# Altium project MCU.PrjPcb (part 3 of 3)

## Sheet Buck_Converter.SchDoc
size A; SheetNumber: 6; SheetTotal: 11
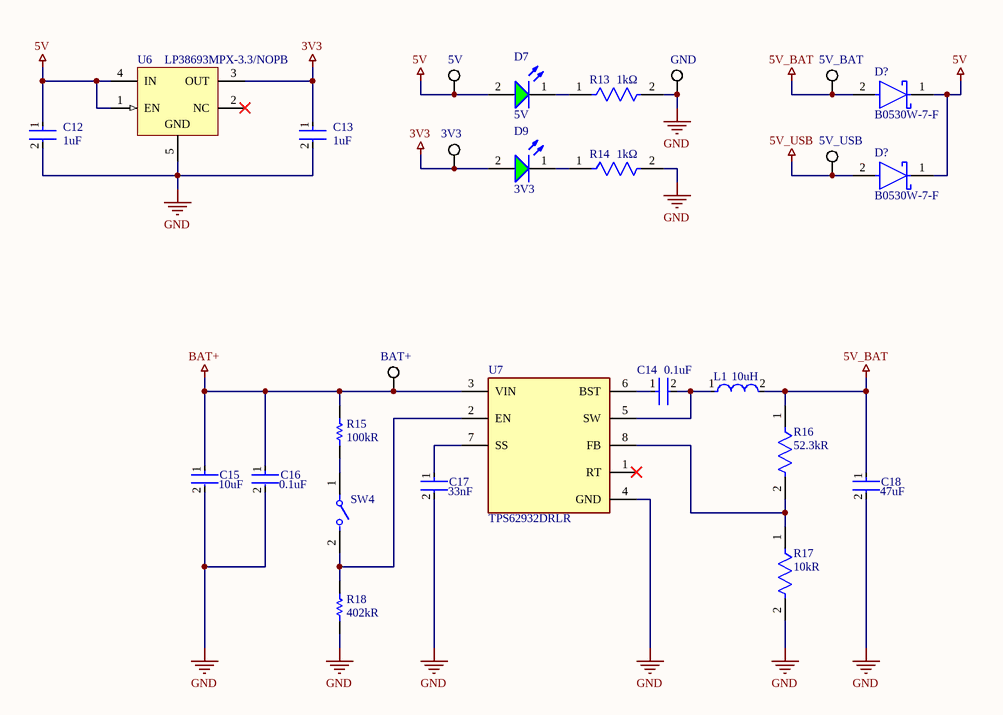
[diagram p5: Buck_Converter.SchDoc]

### Parts
(Parts that share a designator on the sheet are numbered #1, #2 ... from top to bottom, then left to right.)
3V3#2  (no value)  [KSTN-5019_V]
5V#2  (no value)  [KSTN-5019_V]
5V_BAT#2  (no value)  [KSTN-5019_V]
5V_USB#2  (no value)  [KSTN-5019_V]
BAT+#2  (no value)  [KSTN-5019_V]
C12#2  Capacitance: 1uF  [FP-CC0805-0_85-MFG]  (hidden comment: CC0805MKX7R7BB105)
C13#2  Capacitance: 1uF  [FP-CC0805-0_85-MFG]  (hidden comment: CC0805MKX7R7BB105)
C14#2  Capacitance: 0.1uF  [FP-GCD21B-0_15-IPC_B]  (hidden comment: GCD21BR71H104MA01L)
C15#2  Capacitance: 10uF  [FP-GRM21B-0_2-e0_2_0_7-IPC_A]  (hidden comment: GRM21BR61H106KE43L)
C16#2  Capacitance: 0.1uF  [FP-GCD21B-0_15-IPC_B]  (hidden comment: GCD21BR71H104MA01L)
C17#1  Capacitance: 33nF  [FP-C0805C-DN-MFG]  (hidden comment: C0805C333K5RACAUTO)
C18#1  Capacitance: 47uF  [FP-GRM21B-0_2-e0_2_0_7-IPC_A]  (hidden comment: GRM21BR61A476ME15L)
D7  5V  [WL-SMCW_0805_150080xx75000]
D9  3V3  [WL-SMCW_0805_150080xx75000]
D?#1  B0530W-7-F  [FP-SOD123-MFG]
D?#2  B0530W-7-F  [FP-SOD123-MFG]
GND#2  (no value)  [KSTN-5019_V]
L1#2  Inductance: 10uH  [FP-SRP1038A-100M-MFG]  (hidden comment: SRP1038A-100M)
R13#2  Resistance: 1kΩ  [FP-AF0805-IPC_A]  (hidden comment: AF0805FR-071KL)
R14#2  Resistance: 1kΩ  [FP-AF0805-IPC_A]  (hidden comment: AF0805FR-071KL)
R15#2  Resistance: 100kR  [RESC2013X60X30LL20T20]  (hidden comment: SG73S2ATTD1003F)
R16#2  Resistance: 52.3kR  [FP-CRCW0805-e3-IPC_A]  (hidden comment: CRCW080552K3FKEA)
R17#2  Resistance: 10kR  [FP-AF0805-IPC_B]  (hidden comment: AF0805FR-0710KL)
R18#1  Resistance: 402kR  [RESC2013X60X35NL10T20]  (hidden comment: RC0805FR-07402KL)
SW4  L101011MS02Q  [FP-L101011MS02Q-MFG]  (value not drawn)
U6  LP38693MPX-3.3/NOPB  [MP05A_M]
U7  TPS62932DRLR  [FP-DRL0008A-MFG]

### Nets
3V3: 3V3#2.1 C13#2.1 D9.2(A) U6.3(OUT)
5V: 5V#2.1 C12#2.1 D7.2(A) D?#1.1(C) D?#2.1(C) U6.1(EN) U6.4(IN)
5V_BAT: 5V_BAT#2.1 C18#1.1 D?#1.2(A) L1#2.2 R16#2.1
5V_USB: 5V_USB#2.1 D?#2.2(A)
BAT+: BAT+#2.1 C15#2.1 C16#2.1 R15#2.2 U7.3(VIN)
GND: C12#2.2 C13#2.2 C15#2.2 C16#2.2 C17#1.2 C18#1.2 GND#2.1 R13#2.2 R14#2.2 R17#2.2 R18#1.1 U6.5(GND) U7.4(GND)
NetC14#2_1: C14#2.1 U7.6(BST)
NetC14#2_2: C14#2.2 L1#2.1 U7.5(SW)
NetC17#1_1: C17#1.1 U7.7(SS)
NetD7_1: D7.1(K) R13#2.1
NetD9_1: D9.1(K) R14#2.1
NetR15#2_1: R15#2.1 SW4.1
NetR16#2_2: R16#2.2 R17#2.1 U7.8(FB)
NetR18#1_2: R18#1.2 SW4.2 U7.2(EN)

Not connected (* = marked no-connect by the designer): U6 2(NC)*; U7 1(RT)*

### Library data of the parts
3V3#2 5V#2 5V_BAT#2 5V_USB#2 BAT+#2 GND#2 = CMP-1672-00008-1: Test Point, 1 Position SMD, RoHS, Tape and Reel; Manufacturer: Keystone Electronics; Manufacturer Part Number: 5019; Connector Type: Interconnection Device; ComponentLink1Description: Manufacturer URL; Package Quantity: 1000; DatasheetVersion: 03/2014; Packaging: Tape and Reel; ComponentLink2URL: http://www.keyelco.com/product-pdf.cfm?p=1357; ComponentLink1URL: http://www.keyelco.com/; Mount: Surface Mount; Contact Plating: Silver; PackageDescription: 1-Pin Surface Mount Device, Body 3.81 x 2.03 mm; Pins: 1; RoHSCompliant: True; Mounting Technology: Surface Mount; ComponentLink2Description: Datasheet; PackageReference: 5019; Supplier: Digikey; Supplier Part Number: 36-5019CT-ND; RoHS: Yes; Category: Connectors; Stock: 174520; Pricing: 1=0.34, 25=0.2736, 100=0.2234, 250=0.20064, 500=0.19152 (USD); Reach SVHC Compliant: Yes; RoHS Compliant: Yes; ComponentLink3URL: https://datasheet.ciiva.com:443/pdfs/VipMasterIC/IC/KEYC/KEYC-S-A0003063693/KEYC-S-A0003063693-1.pdf?src-supplier=IHS+Markit; ComponentLink3Description: https://datasheet.ciiva.com:443/pdfs/VipMasterIC/IC/KEYC/KEYC-S-A0003063693/KEYC-S-A0003063693-1.pdf?src-supplier=IHS+Markit; ComponentLink4URL: https://datasheet.ciiva.com/16318/m60-2p61-16318395.pdf?src-supplier=Future+Electronics; ComponentLink4Description: https://datasheet.ciiva.com/16318/m60-2p61-16318395.pdf?src-supplier=Future+Electronics; ComponentLink5URL: https://datasheet.ciiva.com/14848/m60-2p61-14848438.pdf?src-supplier=Digikey; ComponentLink5Description: https://datasheet.ciiva.com/14848/m60-2p61-14848438.pdf?src-supplier=Digikey; ComponentLink6URL: https://datasheet.ciiva.com/14848/m60-2p61-14848439.pdf?src-supplier=Digikey; ComponentLink6Description: https://datasheet.ciiva.com/14848/m60-2p61-14848439.pdf?src-supplier=Digikey; ComponentLink7URL: https://datasheet.ciiva.com/14848/m60-2p61-14848437.pdf?src-supplier=Digikey; ComponentLink7Description: https://datasheet.ciiva.com/14848/m60-2p61-14848437.pdf?src-supplier=Digikey; ComponentLink8URL: https://datasheet.ciiva.com/16885/70182998-16885945.pdf?src-supplier=Allied+Electronics; ComponentLink8Description: https://datasheet.ciiva.com/16885/70182998-16885945.pdf?src-supplier=Allied+Electronics
C12#2 C13#2 = CMP-03422-001156-1: CAP CER 1UF 16V X7R 0805; Manufacturer: Yageo; Material: Ceramic; Tolerance: 0.2; Octopart: https://octopart.com/cc0805mkx7r7bb105-yageo-33242308; Footprint Url: http://www.yageo.com/exep/pages/download/literatures/UPY-C_GEN_24.pdf; Height: 0.95mm; Manufacturer Part Number: CC0805MKX7R7BB105; ComponentLink2Description: Datasheet; Device Class L2: Capacitors; Package: CC0805-0.85; RoHS: TRUE; Category: Cap; Device Class L1: Passive Components; Device Class L3: Ceramic Capacitors; Ipc Land Pattern Name: CAPC200125X85; Temperature Range Low: -30°C; ComponentLink2URL: http://www.yageo.com/documents/recent/UPY-GPHC_Y5V_6.3V-to-50V_8.pdf; Temperature: -30°C to +85°C; Automotive: No; Temperature Range High: +85°C; Mouser Description: Multilayer Ceramic Capacitors MLCC - SMD/SMT 1.0uF 16V X7R 20%; Digikey Description: CAP CER 1UF 16V X7R 0805; Voltage Rating: 16 V; Value: 1 uF; Lead Free: Yes; Temperature Characteristic: X7R
C14#2 C16#2 = CMP-06035-004518-1: Chip Multilayer Ceramic Capacitors for Automotive, 0805, 0.10uF, X7R, 15%, 20%, 50V, Grade 1
C15#2 = CMP-06035-004402-1: Chip Multilayer Ceramic Capacitors for General Purpose, 0805, 10uF, X5R, 15%, 10%, 50V; Voltage Rating (DC): 50V; Dielectric: X5R; Tolerance: 10%; Thickness: 1.25mm; Length: 2mm; Width: 1.25mm
C17#1 = CMP-2007-01069-2: CAP CER 0.033UF 50V X7R 0805; Manufacturer: KEMET; Tolerance: 0.1; Temperature Coefficient: 30ppm/°C; Value: 33,000 pF; Material: Ceramic; Temperature Characteristic: X7R; Ipc Land Pattern Name: CAPC200125X78; ComponentLink2Description: Datasheet; Temperature Range High: +125°C; Lead Free: Yes; Height: 0.88mm; Temperature: -55°C to +125°C; Voltage Rating: 50 V; Package: C0805C-DN; Mouser Description: SMD Multilayer Ceramic Capacitor, AEC-Q200 C Series, 0.033 F, 10%, X7R, 50 V, 0805 [2012 Metric]; RoHS: TRUE; Device Class L2: Capacitors; Device Class L1: Passive Components; Digikey Description: CAP CER 0.033UF 50V X7R 0805; Automotive: No; Temperature Range Low: -55°C; Category: Cap; Manufacturer Part Number: C0805C333K5RACAUTO; Device Class L3: Ceramic Capacitors; ComponentLink2URL: https://content.kemet.com/datasheets/KEM_C1003_C0G_SMD.pdf; Octopart: https://octopart.com/c0805c333k5racauto-kemet-21768584
C18#1 = CMP-2000-06341-2: Chip Multilayer Ceramic Capacitors for General Purpose, 0805, 47uF, X5R, 15%, 20%, 10V; Dissipation Factor: 0.035%; Length: 2mm; Voltage Rating: 10V; Mount: Surface Mount; Width: 0.049inch; Voltage Rating (DC): 10V; Lead Free: Lead Free; REACH SVHC: No SVHC; Termination: SMD/SMT; Case/Package: 0805; Dielectric: X5R; Packaging: Tape and Reel; Max Operating Temperature: 85°C; Tolerance: 20%; Thickness: 0.057inch; Dielectric Material: Ceramic; Min Operating Temperature: -55°C; Height: 1.25mm; Case Code (Imperial): 0805; Case Code (Metric): 2012; Depth: 1.25mm; Voltage: 10V
D7 = CMP-1426-00007-3: WURTH ELEKTRONIK - 150080GS75000 - LED, Green, SMD, 0805, 30 mA, 3.2 V, 520 nm; Forward Voltage: 3.2V; Viewing Angle: 140°; Power Dissipation: 105mW; Peak Wavelength: 515nm; Luminous Intensity: 450mcd; Wavelength: 525nm; Max Junction Temperature (Tj): 95°C; Forward Current: 100mA; Test Current: 20mA; Lens Style: Clear, Rectangular; Length: 2mm; Case/Package: 0805; Case Code (Metric): 2012; Color: Green; Max Reverse Voltage (DC): 5V; Height: 700µm; Width: 1.25mm; Packaging: Tape and Reel; Mount: Surface Mount; REACH SVHC: Unknown; RoHS: Compliant; Min Operating Temperature: -40°C; Reverse Voltage: 5V; Max Operating Temperature: 85°C; Dominant Wavelength: 525nm; Case Code (Imperial): 0805
D9 = CMP-1426-00007-3: WURTH ELEKTRONIK - 150080GS75000 - LED, Green, SMD, 0805, 30 mA, 3.2 V, 520 nm; Forward Voltage: 3.2V; Viewing Angle: 140°; Power Dissipation: 105mW; Peak Wavelength: 515nm; Max Reverse Voltage (DC): 5V; Luminous Intensity: 450mcd; Wavelength: 525nm; Max Junction Temperature (Tj): 95°C; Forward Current: 100mA; Test Current: 20mA; Lens Style: Clear, Rectangular; Length: 2mm; Case/Package: 0805; Case Code (Metric): 2012; Color: Green; Height: 700µm; Width: 1.25mm; Packaging: Tape and Reel; Mount: Surface Mount; REACH SVHC: Unknown; RoHS: Compliant; Min Operating Temperature: -40°C; Reverse Voltage: 5V; Max Operating Temperature: 85°C; Dominant Wavelength: 525nm; Case Code (Imperial): 0805
D?#1 D?#2 = CMP-2000-05879-2: DIODE SCHOTTKY 30V 500MA SOD123; Manufacturer: Diodes Inc.; Max Surge Forward Current: 5.5A; Forward Current: 0.5A; Max Junction Temp: +125°C; Standoff Height: 0mm; Capacitance: 170pF; Value: 170pF; Peak Reverse Current: 130uA; Footprint Url: https://www.diodes.com/assets/Package-Files/SOD123.pdf; Device Class L1: Discrete Semiconductors; ComponentLink2Description: Datasheet; Mouser Description: Schottky Diodes & Rectifiers 30V 410mW; Device Class L3: Schottky Diodes; Package: SOD123; Temperature: -65°C to +125°C; Temperature Range Low: -65°C; Lead Free: Yes; Digikey Description: DIODE SCHOTTKY 30V 500MA SOD123; Ipc Land Pattern Name: SOD365155X123-2; Automotive: No; Octopart: https://octopart.com/b0530w-7-f-diodes+inc.-325721; Device Class L2: Diodes; ComponentLink2URL: https://www.diodes.com/assets/Datasheets/ds30139.pdf; RoHS: TRUE; Height: 1.45mm; Max Repetitive Reverse Voltage: 30V; Category: Diode; Temperature Range High: +125°C; Manufacturer Part Number: B0530W-7-F; Reverse Voltage: 30V
L1#2 = CMP-07248-000083-1: FIXED IND 10UH 7.5A 30 MOHM SMD; Tolerance: 20%; Test Frequency: 100kHz; Self Resonant Frequency: 10MHz; Q Factor: 20; Core Material: Carbonyl Powder; Shielding: Shielded; DC Resistance (DCR): 30mR; Saturation Current: 12A; Mount: Surface Mount; Military Standard: Not; Max Operating Temperature: 150°C; Length: 11mm; Min Operating Temperature: -40°C; Ratings: AEC-Q200; Termination: SMD/SMT; RMS Current (Irms): 7.5A; Packaging: Tape and Reel; RoHS Compliant: Yes; Width: 0.394inch; Height: 3.8mm; Package Quantity: 500; DC Current: 7.5A; Case/Package: Nonstandard; Depth: 10.3mm; Max DC Current: 7.5A; Height - Seated (Max): 0.157inch; REACH SVHC: No SVHC; Resistor Type: Wirewound; Current Rating: 7.5A; Inductance Tolerance: 20%
R13#2 R14#2 = CMP-03412-043866-1: Anti-Sulfurated Chip Resistor Automotive Grade 1kΩ 1% 0.125W ±100ppm/°C 0805; Max Power Dissipation: 125mW; Number of Terminations: 2; Series: AF; Length: 0.079inch; Min Operating Temperature: -55°C; Packaging: Tape and Reel; Features: Moisture Resistant; Tolerance: 1%; Resistor Type: Thick Film; RoHS Compliant: Yes; Case/Package: 0805; Height: 0.024inch; Max Operating Temperature: 155°C; Temperature Coefficient: 100ppm/°C; Width: 0.049inch
R15#2 = CMP-2001-02684-1: Manufacturer: KOA Speer; Part Number: SG73S2ATTD1003F
R16#2 = CMP-1013-00705-3: RES Thick Film, 52.3kΩ, 1%, 0.125W, 100ppm/°C, 0805; Voltage Rating: 150V; Power Rating: 125mW; Min Operating Temperature: -55°C; Military Standard: Not; Features: Automotive AEC-Q200; Composition: Thick Film; Case/Package: 0805; Case Code (Imperial): 0805; Length: 2mm; Package Quantity: 10; Radiation Hardening: No; Max Operating Temperature: 155°C; Contact Plating: Tin; Case Code (Metric): 2012; Temperature Coefficient: 100ppm/°C; Weight: 0.000194oz; Number of Pins: 2; Number of Terminations: 2; Depth: 1.25mm; Termination: Solder; Tolerance: 1%; Max Power Dissipation: 125mW; Lead Free: Lead Free; Packaging: Tape and Reel; Width: 0.049inch; Height: 0.45mm; Voltage Rating (DC): 150V
R17#2 = CMP-03412-045858-1: Anti-Sulfurated Chip Resistor Automotive Grade 10kΩ 1% 0.125W ±100ppm/°C 0805; Power Rating: 125mW; Voltage Rating: 150V; Packaging: Tape and Reel; Max Operating Temperature: 155°C; Height: 0.024inch; Features: Moisture Resistant; Case Code (Imperial): 0805; Number of Terminations: 2; Series: AF; Termination: SMD/SMT; Package Quantity: 5000; Temperature Coefficient: 100ppm/°C; RoHS Compliant: Yes; Width: 1.25mm; Weight: 0.000194oz; Tolerance: 1%; Case/Package: 0805; Resistor Type: Thick Film; Max Power Dissipation: 125mW; Case Code (Metric): 2012; Length: 0.079inch; Min Operating Temperature: -55°C
R18#1 = CMP-2001-01136-1: Manufacturer: Yageo; Part Number: RC0805FR-07402KL
SW4 = CMP-10038-000020-1: SWITCH SLIDE SPST 4A 125V; Actuator Length: 5.08mm; Actuator Type: Standard; Contact Current Rating: 2A; Electrical Life: 10000Cycles; Switch Function: On-Off; Voltage Rating (DC): 28V; Actuator Color: Black; Actuator Material: Nylon; Switch Travel: 3.81mm; Max Voltage Rating (AC): 250V; Max Current Rating: 4A; Contact Plating: Silver; Throw Configuration: SPST; Depth: 10.8mm; Package Quantity: 1; Length: 19.1mm; Current Rating: 4A; Max Operating Temperature: 65°C; Orientation: Straight; Radiation Hardening: No; Termination: PC Pins; Max Voltage Rating (DC): 125V; Series: L; Min Operating Temperature: -30°C; Contact Material: Copper; Lead Free: Lead Free; Mount: Through Hole; RoHS Compliant: Yes; Voltage Rating (AC): 125V; Packaging: Bulk; Housing Material: Nylon
U6 = CMP-0062-02672-1: 500mA Low Dropout CMOS Linear Regulators Stable with Ceramic Output Capacitors, 5-pin SOT-223, 2000 Reel; Manufacturer: National Semiconductor; PowerWise: Y; CompType: LDO IC; PinCount: 5; Code_JEDEC: TO-261-AB; ComponentLink3URL: http://www.national.com/pf/LP/LP38693.html; RoHS: Y; ComponentLink1URL: http://www.national.com/; Code_IPC: SOT223-5; PartNumber: LP38693MPX-3.3/NOPB; DatasheetVersion: Jun-2011; High-Reliability: Y; PackageReference: MP05A; ComponentLink4URL: http://www.national.com/packaging/folders/mp05a.html; ComponentLink2Description: LP38693 Datasheet; ComponentLink4Description: MP05A Package Page; PackageDescription: Moldec SOT-223, 6.50 x 3.56 x 1.6mm Body, 5 Lead, 1.5mm Pitch; ComponentLink2URL: http://www.national.com/ds/LP/LP38691.pdf; ComponentLink1Description: Manufacturer URL; ComponentLink3Description: LP38693 Web Page; PackageVersion: revA, Jan-2000
U7 = CMP-04918-000714-1: 3.8-V TO 30-V INPUT, 2-A, 200-KH

## Sheet ESP32-S3.SchDoc
size A; SheetNumber: 7; SheetTotal: 11
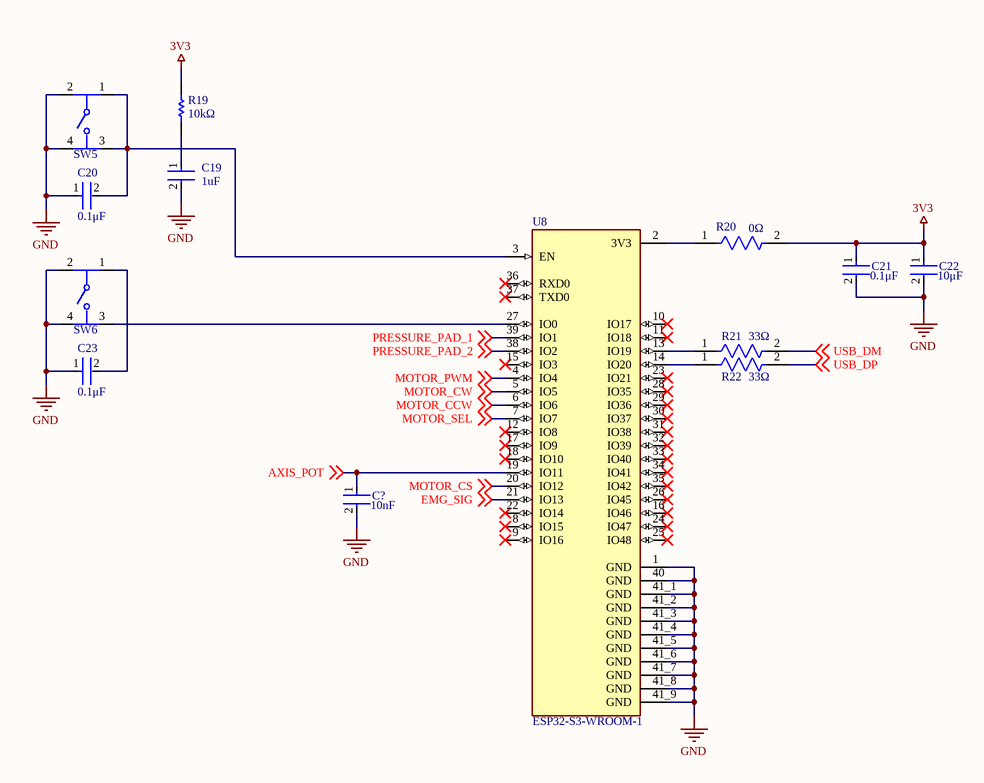
[diagram p6: ESP32-S3.SchDoc]

### Parts
(Parts that share a designator on the sheet are numbered #1, #2 ... from top to bottom, then left to right.)
C19#1  Capacitance: 1uF  [FP-CC0805-0_85-MFG]  (hidden comment: CC0805MKX7R7BB105)
C20#1  Capacitance: 0.1μF  [FP-C0805C-DN-MFG]  (hidden comment: C0805C104K8RACTU)
C21  Capacitance: 0.1μF  [FP-C0805C-DN-MFG]  (hidden comment: C0805C104K8RACTU)
C22  Capacitance: 10μF  [FP-GRT21B-0_2-IPC_B]  (hidden comment: GRT21BC71E106KE13L)
C23  Capacitance: 0.1μF  [FP-C0805C-DN-MFG]  (hidden comment: C0805C104K8RACTU)
C?  Capacitance: 10nF  [FP-C0805C103K8RACAUTO-MFG]  (hidden comment: C0805C103K8RACAUTO)
R19#1  Resistance: 10kΩ  [RESC2013X60X35NL10T20]  (hidden comment: RC0805JR-1310KL)
R20#1  Resistance: 0Ω  [FP-RCC0805-e3-MFG]  (hidden comment: RCC08050000Z0EA)
R21  Resistance: 33Ω  [FP-AC0805-MFG]  (hidden comment: AC0805FR-0733RL)
R22  Resistance: 33Ω  [FP-AC0805-MFG]  (hidden comment: AC0805FR-0733RL)
SW5  TL1105AF160Q  [FP-TL1105AF160Q-MFG]  (value not drawn)
SW6  TL1105AF160Q  [FP-TL1105AF160Q-MFG]  (value not drawn)
U8  ESP32-S3-WROOM-1  [ESP32-S3-WROOM-1]

### Nets
3V3: C21.1 C22.1 R19#1.2 R20#1.2
GND: C19#1.2 C20#1.1 C21.2 C22.2 C23.1 C?.2 SW5.2 SW5.4 SW6.2 SW6.4 U8.1(GND) U8.40(GND) U8.41_1(GND) U8.41_2(GND) U8.41_3(GND) U8.41_4(GND) U8.41_5(GND) U8.41_6(GND) U8.41_7(GND) U8.41_8(GND) U8.41_9(GND)
AXIS_POT: C?.1 U8.19(IO11) ; off-sheet AXIS_POT
EMG_SIG: U8.21(IO13) ; off-sheet EMG_SIG
MOTOR_CCW: U8.6(IO6) ; off-sheet MOTOR_CCW
MOTOR_CS: U8.20(IO12) ; off-sheet MOTOR_CS
MOTOR_CW: U8.5(IO5) ; off-sheet MOTOR_CW
MOTOR_PWM: U8.4(IO4) ; off-sheet MOTOR_PWM
MOTOR_SEL: U8.7(IO7) ; off-sheet MOTOR_SEL
PRESSURE_PAD_1: U8.39(IO1) ; off-sheet PRESSURE_PAD_1
PRESSURE_PAD_2: U8.38(IO2) ; off-sheet PRESSURE_PAD_2
USB_DM: R21.2 ; off-sheet USB_DM
USB_DP: R22.2 ; off-sheet USB_DP
NetC19#1_1: C19#1.1 R19#1.1
NetC20#1_2: C20#1.2 SW5.1 SW5.3 U8.3(EN)
NetC23_2: C23.2 SW6.1
NetR20#1_1: R20#1.1 U8.2(3V3)
NetR21_1: R21.1 U8.13(IO19)
NetR22_1: R22.1 U8.14(IO20)
NetSW6_3: SW6.3 U8.27(IO0)

Not connected (* = marked no-connect by the designer): U8 8(IO15)* 9(IO16)* 10(IO17)* 11(IO18)* 12(IO8)* 15(IO3)* 16(IO46)* 17(IO9)* 18(IO10)* 22(IO14)* 23(IO21)* 24(IO47)* 25(IO48)* 26(IO45)* 28(IO35)* 29(IO36)* 30(IO37)* 31(IO38)* 32(IO39)* 33(IO40)* 34(IO41)* 35(IO42)* 36(RXD0)* 37(TXD0)*

### Library data of the parts
C19#1 = CMP-03422-001156-1: as C12#2 on sheet Buck_Converter; Octopart: https://octopart.com/cc0805mkx7r7bb105-yageo-33242308; Footprint Url: http://www.yageo.com/exep/pages/download/literatures/UPY-C_GEN_24.pdf; Height: 0.95mm; Manufacturer Part Number: CC0805MKX7R7BB105; ComponentLink2Description: Datasheet; Device Class L2: Capacitors; Package: CC0805-0.85; RoHS: TRUE; Category: Cap; Device Class L1: Passive Components; Device Class L3: Ceramic Capacitors; Ipc Land Pattern Name: CAPC200125X85; Temperature Range Low: -30°C; ComponentLink2URL: http://www.yageo.com/documents/recent/UPY-GPHC_Y5V_6.3V-to-50V_8.pdf; Temperature: -30°C to +85°C; Automotive: No; Temperature Range High: +85°C; Mouser Description: Multilayer Ceramic Capacitors MLCC - SMD/SMT 1.0uF 16V X7R 20%; Digikey Description: CAP CER 1UF 16V X7R 0805; Voltage Rating: 16 V; Value: 1 uF; Lead Free: Yes; Temperature Characteristic: X7R
C20#1 C21 C23 = CMP-2007-00281-2: CAP CER 0.1UF 10V 10% X7R 0805; Manufacturer: KEMET; Temperature Coefficient: 30ppm/°C; Tolerance: 0.1; Material: Ceramic; Value: 0.10 μF; Ipc Land Pattern Name: CAPC200125X78; Voltage Rating: 10 V; Temperature: -55°C to +125°C; Octopart: https://octopart.com/c0805c104k8ractu-kemet-9139201; RoHS: TRUE; Category: Cap; Temperature Range High: +125°C; Device Class L1: Passive Components; Manufacturer Part Number: C0805C104K8RACTU; Mouser Description: Multilayer Ceramic Capacitors MLCC - SMD/SMT 10volts 0.1uF X7R 10%; Device Class L2: Capacitors; Automotive: No; Temperature Range Low: -55°C; Temperature Characteristic: X7R; Lead Free: Yes; Device Class L3: Ceramic Capacitors; Height: 0.88mm; ComponentLink2URL: https://content.kemet.com/datasheets/KEM_C1003_C0G_SMD.pdf; Digikey Description: CAP CER 0.1UF 10V 10% X7R 0805; Package: C0805C-DN; ComponentLink2Description: Datasheet
C22 = CMP-06035-008164-1: Multi-Layer Ceramic Capacitor 10uF 25V X7S ±10% 0805 Emboss T/R
C? = CMP-00212-126448506-1: C0805C103K8RACAUTO Cap, 0.01UF, 10V, Mlcc, 0805 Rohs Compliant: Yes; Material: Ceramic; Dielectric: X7R; Tolerance: 10%; Height: 880µm; NexarPartId: 126448506; Voltage Rating: 10V; Voltage Rating (DC): 10V; Min Operating Temperature: -55°C; Max Operating Temperature: 125°C; Case/Package: 0805; RoHS: Compliant
R19#1 = CMP-2001-01415-1: Manufacturer: Yageo; Part Number: RC0805JR-1310KL
R20#1 = CMP-00030-108211984-1: RCC08050000Z0EA Res Thick Film 0805 0 Ohm Conformal Coated Pad SMD Automotive AEC-Q200 T/R; Voltage Rating: 200V; Power Rating: 250mW; Composition: Thick Film; Max Operating Temperature: 155°C; Case/Package: 0805; Height: 500µm; NexarPartId: 108211984; Min Operating Temperature: -55°C
R21 R22 = CMP-03412-037241-1: RES SMD 33 OHM 1% 1/8W 0805; Manufacturer: Yageo; Automotive Grade: Grade 0; Value: 33Ω; Voltage Rating: 150V; Tolerance: 0.01; Octopart: https://octopart.com/ac0805fr-0733rl-yageo-46503501; Device Class L2: Resistors; Temperature: -55°C to +155°C; Composition: Thick Film; ComponentLink2URL: http://www.yageo.com/documents/recent/PYu-AC_51_RoHS_L_6.pdf; Automotive: Yes; Lead Free: Yes; Category: Res; Package: AC0805; Temperature Range Low: -55°C; Device Class L3: Chip SMD Resistors; Temperature Range High: +155°C; Mouser Description: Thick Film Resistors - SMD 1/8W 33ohm 1% AEC-Q200; Footprint Url: http://www.yageo.com/exep/pages/download/literatures/PYu-R_Mount_10.pdf; Power Rating: 1/8W; RoHS: TRUE; ComponentLink2Description: Datasheet; Device Class L1: Passive Components; Height: 0.6mm; Series: AC; Digikey Description: RES SMD 33 OHM 1% 1/8W 0805; Ipc Land Pattern Name: RESC200125X50; Manufacturer Part Number: AC0805FR-0733RL
SW5 SW6 = CMP-17879-000016-1: SWITCH TACTILE SPST-NO 0.05A 12V; Mechanical Life: 100000Cycles; Contact Current Rating: 50mA; Contact Resistance: 100mR; Switch Function: Off-Mom; Actuator Type: Standard; Actuator Length: 1.4mm; Max Voltage Rating (DC): 50V; Throw Configuration: SPST; Actuator Material: Nylon; Illumination Type: Non-Illuminated; Switch Travel: 0.25mm; Operating Force: 160gf; Package Quantity: 750; Width: 6mm; Series: TL1105; Voltage Rating (DC): 12V; Length: 6mm; Contact Plating: Silver; Color: Black; Housing Material: Nylon; Min Operating Temperature: -20°C; Lead Free: Lead Free; Mount: Through Hole; Termination: PC Pin; RoHS Compliant: Yes; Orientation: Straight; Max Operating Temperature: 70°C; Reach SVHC Compliant: Yes; Packaging: Bulk; Electrical Life: 100000Cycles; Current Rating: 50mA; Contact Material: Bronze; Size: 6mm
U8 = ESP32-S3-WROOM-1: MF: {'manufacturer': u'Espressif Systems'}; MP: ESP32-S3-WROOM-1-N8; Package: None; Price: None; Value: *; Availability: Unavailable; Supplier 1: DigiKey; Supplier Part Number 1: 5407-ESP32-S3-WROOM-1-N8CT-ND

## Sheet Axis_Potentiometer.SchDoc
size A; SheetNumber: 5; SheetTotal: 4
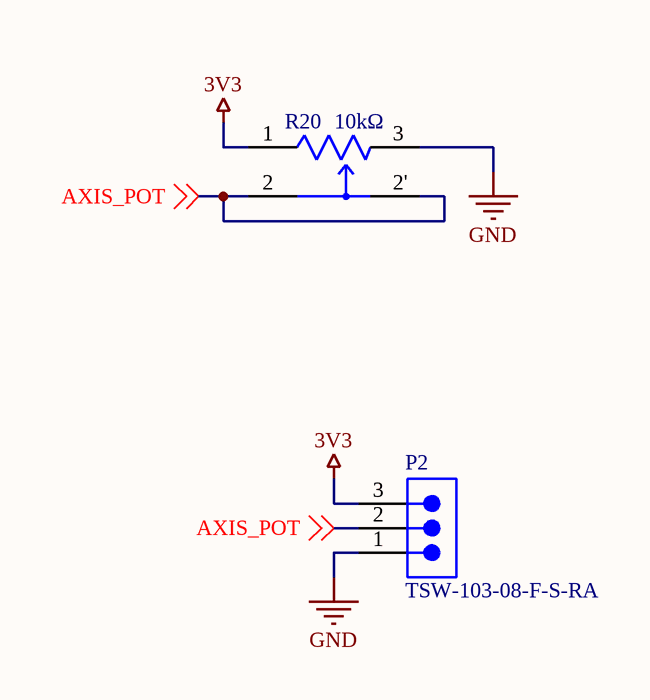
[diagram p7: Axis_Potentiometer.SchDoc]

### Parts
(Parts that share a designator on the sheet are numbered #1, #2 ... from top to bottom, then left to right.)
P2  TSW-103-08-F-S-RA  [SMTC-TSW-103-08-X-S-RA]
R20#2  Resistance: 10kΩ  [FP-EVW-AE4001B14-MFG]  (hidden comment: EVW-AE4001B14)

### Nets
3V3: P2.3 R20#2.1
GND: P2.1 R20#2.3
AXIS_POT: P2.2 R20#2.2 R20#2.2' ; off-sheet AXIS_POT

### Library data of the parts
P2 = CMP-1024-00344-1: 0.025" SQ Post Header, Through-hole, Right Angle, -55 to 125 degC, 2.54 mm Pitch, 3-Pin, Male, RoHS; Manufacturer: Samtec; Pitch: 2.54 mm; PackageVersion: DM, 8/1988; ComponentLink3Description: Package Specification; ComponentLink2Description: Datasheet; PackageDescription: .025[0.64] SQ. Post Terminal Strip Assembly; ComponentLink3URL: http://www.samtec.com/documents/webfiles/cpdf/TSW-XXX-XX-XXX-X-XX-XXX-MKT.pdf; ComponentLink1URL: http://www.samtec.com; Mounting Technology: Through-hole; ComponentLink2URL: http://www.samtec.com/documents/webfiles/pdf/TSW_TH.PDF; RoHS: True; Temperature Range: -55 to 125 degC; Orientation: Right Angle; DatasheetVersion: F-214; ComponentLink1Description: Manufacturer URL; PackageReference: TSW-103-08-X-S-RA; PartNumber: TSW-103-08-F-S-RA
R20#2 = CMP-00287-39595731-1: EVW-AE4001B14 Res POT 10K Ohm 30% 1/20W 4mm (10.6 X 15.4 X 3.4mm) Thru-Hole Embossed T/R; Max Supply Voltage: 5V; Power Rating: 50mW; Sensing Method: Resistive; Linearity: 2%; Min Operating Temperature: -40°C; Tolerance: 30%; NexarPartId: 39595731; Termination: SMD/SMT; Contact Plating: Silver; Mount: Surface Mount, Through Hole; Packaging: Cut Tape; Length: 10.6mm; Lead Free: Lead Free; Depth: 15.4mm; RoHS: Compliant; Military Standard: Not; Radiation Hardening: No; Composition: Potentiometer; Min Supply Voltage (DC): 5V; Schedule B: 8536509065, 8536509065; Max Operating Temperature: 85°C; Number of Pins: 4; Type: Potentiometer; REACH SVHC: Unknown

## Sheet Power_Switch.SchDoc
size A; SheetNumber: 9; SheetTotal: 9

## Sheet Motor_Driver.SchDoc
size A; SheetNumber: 10; SheetTotal: 11
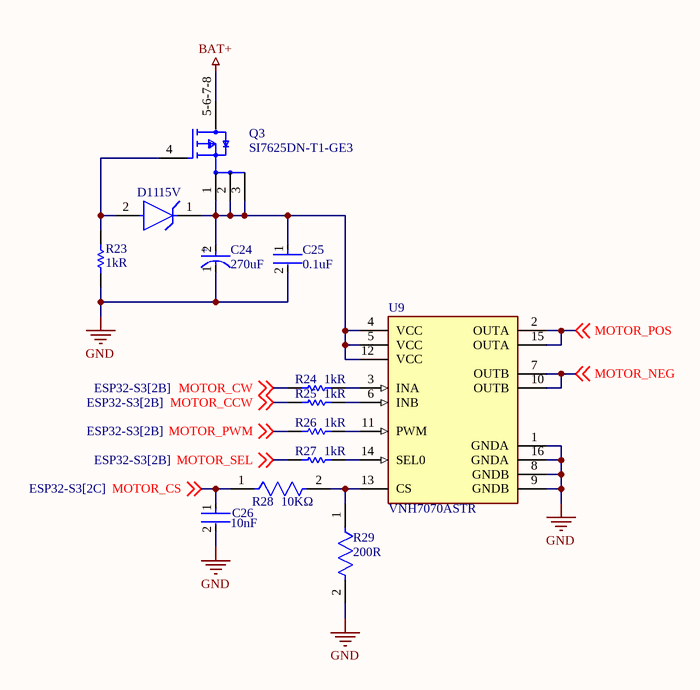
[diagram p8: Motor_Driver.SchDoc]

### Parts
C24  Capacitance: 270uF  [FP-EEH-G-V-MFG]  (hidden comment: EEHZA1V271V)
C25  Capacitance: 0.1uF  [FP-GCD21B-0_15-IPC_B]  (hidden comment: GCD21BR71H104MA01L)
C26  Capacitance: 10nF  [FP-C0805C103K8RACAUTO-MFG]  (hidden comment: C0805C103K8RACAUTO)
D11  Nom Zener Voltage: 15V  [FP-SOD123-MFG]  (hidden comment: MMSZ5245B-7-F)
Q3  SI7625DN-T1-GE3  [FP-S16-2667-SINGLE-MFG]
R23  Resistance: 1kR  [RESC2013X60X35LL10T20]  (hidden comment: AC0805JR-071KL)
R24  Resistance: 1kR  [RESC2013X60X35LL10T20]  (hidden comment: AC0805JR-071KL)
R25  Resistance: 1kR  [RESC2013X60X35LL10T20]  (hidden comment: AC0805JR-071KL)
R26  Resistance: 1kR  [RESC2013X60X35LL10T20]  (hidden comment: AC0805JR-071KL)
R27  Resistance: 1kR  [RESC2013X60X35LL10T20]  (hidden comment: AC0805JR-071KL)
R28  Resistance: 10KΩ  [FP-SR0805-MFG]  (hidden comment: SR0805FR-4710KL)
R29  Resistance: 200R  [FP-CRCW0805-HPe3-IPC_B]  (hidden comment: CRCW0805200RFKEAHP)
U9  VNH7070ASTR  [FP-SO-16N-GAPGCFT00818-MFG]

### Nets
BAT+: Q3.5-6-7-8(D)
GND: C24.1(C) C25.2 C26.2 R23.1 R29.2 U9.1(GNDA) U9.8(GNDB) U9.9(GNDB) U9.16(GNDA)
MOTOR_CCW: R25.1 ; off-sheet MOTOR_CCW
MOTOR_CS: C26.1 R28.1 ; off-sheet MOTOR_CS
MOTOR_CW: R24.1 ; off-sheet MOTOR_CW
MOTOR_NEG: U9.7(OUTB) U9.10(OUTB) ; off-sheet MOTOR_NEG
MOTOR_POS: U9.2(OUTA) U9.15(OUTA) ; off-sheet MOTOR_POS
MOTOR_PWM: R26.1 ; off-sheet MOTOR_PWM
MOTOR_SEL: R27.1 ; off-sheet MOTOR_SEL
NetC24_2: C24.2(A) C25.1 D11.1(C) Q3.1(S) Q3.2(S) Q3.3(S) U9.4(VCC) U9.5(VCC) U9.12(VCC)
NetD11_2: D11.2(A) Q3.4(G) R23.2
NetR24_2: R24.2 U9.3(INA)
NetR25_2: R25.2 U9.6(INB)
NetR26_2: R26.2 U9.11(PWM)
NetR27_2: R27.2 U9.14(SEL0)
NetR28_2: R28.2 R29.1 U9.13(CS)

### Notes on the sheet
- (in symbol CMP-05428-000576-1) +

### Library data of the parts
C24 = CMP-05428-000576-1: Aluminum Hybrid Polymer Capacitors 270uF 20% 35V Life 10000Hours AEC-Q200 RADIAL SMT; ESR (Equivalent Series Resistance): 20mR; Series: ZA; Ratings: AEC-Q200; Resistor Type: Hybrid; Tolerance: 20%; RoHS Compliant: Yes; Max Operating Temperature: 105°C; Min Operating Temperature: -55°C; Packaging: Cut Tape; Life (Hours): 10000Hour; Voltage Rating: 35V; Mount: Surface Mount; Case/Package: Radial
C25 = CMP-06035-004518-1: as C14#2 on sheet Buck_Converter
C26 = CMP-00212-126448506-1: as C? on sheet ESP32-S3; Height: 880µm; NexarPartId: 126448506; Voltage Rating: 10V; Voltage Rating (DC): 10V; Min Operating Temperature: -55°C; Max Operating Temperature: 125°C; Case/Package: 0805; RoHS: Compliant
D11 = CMP-12792-000001-1: DIODE ZENER 15V 500MW SOD123; Manufacturer: Diodes Inc.; Power Dissipation: 370mW; Max Zener Voltage: 15.75V; Max Junction Temp: +150°C; Zener Impedance: 16Ω; Standoff Height: 0mm; Reverse Voltage: 11V; Max Reverse Leakage Current: 0.1uA; Device Class L3: Zener Diodes; Device Class L2: Diodes; Automotive: No; Device Class L1: Discrete Semiconductors; ComponentLink2URL: https://www.diodes.com/assets/Datasheets/ds18010.pdf; Package: SOD123; ComponentLink2Description: Datasheet; Digikey Description: DIODE ZENER 15V 500MW SOD123; RoHS: TRUE; Temperature: -65°C to +150°C; Octopart: https://octopart.com/mmsz5245b-7-f-diodes+inc.-332054; Mouser Description: Zener Diodes 15V 500mW; Height: 1.45mm; Temperature Range Low: -65°C; Lead Free: Yes; Manufacturer Part Number: MMSZ5245B-7-F; Footprint Url: https://www.diodes.com/assets/Package-Files/SOD123.pdf; Category: Diode; Temperature Range High: +150°C
Q3 = CMP-00030-44451668-1: SI7625DN-T1-GE3 P-Channel 30 V 7 mO 5126 nC Surface Mount Power Mosfet - PowerPAK-1212-8; Number of Channels: 1; Max Power Dissipation: 52W; Drain to Source Resistance: 7mΩ; Threshold Voltage: -1V; Power Dissipation: 3.7W; Input Capacitance: 4.427nF; Element Configuration: Single; Gate to Source Voltage (Vgs): 20V; Drain to Source Voltage (Vdss): -30V; Continuous Drain Current (ID): 17.3A; Lead Free: Lead Free; Number of Pins: 8; Min Operating Temperature: -55°C; NexarPartId: 44451668; Schedule B: 8541290080, 8541290080; Radiation Hardening: No; Rds On Max: 7mΩ; Number of Elements: 1; Max Operating Temperature: 150°C; Mount: Surface Mount; Resistance: 7MΩ; Packaging: Digi-Reel®; REACH SVHC: No SVHC; RoHS: Compliant
R23-R27 = CMP-2001-04511-1: Manufacturer: Yageo; Part Number: AC0805JR-071KL
R28 = CMP-03412-005404-1: RES SMD 0805 1/2W 1% 10K OHM; Manufacturer: Yageo; Value: 10KΩ; Power Rating: 0.5W; Voltage Rating: 150V; Tolerance: 0.01; Automotive Grade: Grade 0; RoHS: TRUE; Package: SR0805; Temperature: -55°C to +155°C; Composition: Thick Film; Lead Free: Yes; Ipc Land Pattern Name: RESC200125X50; Footprint Url: http://www.yageo.com/exep/pages/download/literatures/PYu-R_Mount_10.pdf; ComponentLink2URL: http://www.yageo.com/documents/recent/PYu-SR_D_F%20tol_RoHS_L_3.pdf; Series: SR; Device Class L3: Chip SMD Resistors; Manufacturer Part Number: SR0805FR-4710KL; Device Class L2: Resistors; Digikey Description: RES SMD 0805 1/2W 1% 10K OHM; Category: Res; Temperature Range Low: -55°C; ComponentLink2Description: Datasheet; Automotive: Yes; Height: 0.6mm; Octopart: https://octopart.com/sr0805fr-4710kl-yageo-91478094; Device Class L1: Passive Components; Temperature Range High: +155°C
R29 = CMP-02407-008327-1: RES Thick Film, 200Ω, 1%, 0.5W, 100ppm/°C, 0805; Max Power Dissipation: 500mW; Min Operating Temperature: -55°C; Composition: Thick Film; Depth: 1.25mm; Max Operating Temperature: 155°C; Case/Package: 0805; Height: 0.024inch; Length: 2mm; Package Quantity: 5000; Military Standard: Not; Mount: Surface Mount; Contact Plating: Tin; Width: 0.049inch; Radiation Hardening: No; Packaging: Tape and Reel; Features: Automotive AEC-Q200; Number of Terminations: 2; Tolerance: 1%; Temperature Coefficient: 100ppm/°C; Lead Free: Lead Free
U9 = CMP-2000-07519-2: IC MOTOR DRIVER 4V-28V 16SOIC; Manufacturer: STMicroelectronics; Standoff Height: 0.1mm; Number Of Outputs: 2; Max Junction Temp: +150°C; Output Current: 15A; Max Supply Voltage: 28V; Automotive Grade: Grade 0; Motor Type: Brushed; Min Supply Voltage: 4V; Nominal Supply Current: 2-3.5mA; Digikey Description: IC MOTOR DRIVER 4V-28V 16SOIC; Device Class L1: Integrated Circuits (ICs); Ipc Land Pattern Name: SOIC127P600X175-16; Device Class L2: Power Management ICs; ComponentLink2Description: Datasheet; ComponentLink2URL: https://www.st.com/resource/en/datasheet/vnh7070as.pdf; Height: 1.75mm; RoHS: TRUE; Manufacturer Part Number: VNH7070ASTR; Octopart: https://octopart.com/vnh7070astr-stmicroelectronics-66668687; Temperature Range Low: -40°C; Mouser Description: STMicroelectronics VNH7070ASTR Motor Driver IC 16-Pin, SOIC; Device Class L3: Motor Drivers; Lead Free: Yes; Temperature: -40°C to +150°C; Automotive: Yes; Package: SO-16N-GAPGCFT00818; Temperature Range High: +150°C; Category: IC; Footprint Url: https://www.st.com/resource/en/datasheet/l6566a.pdf

## Sheet Connectors.SchDoc
size A; SheetNumber: 4; SheetTotal: 4
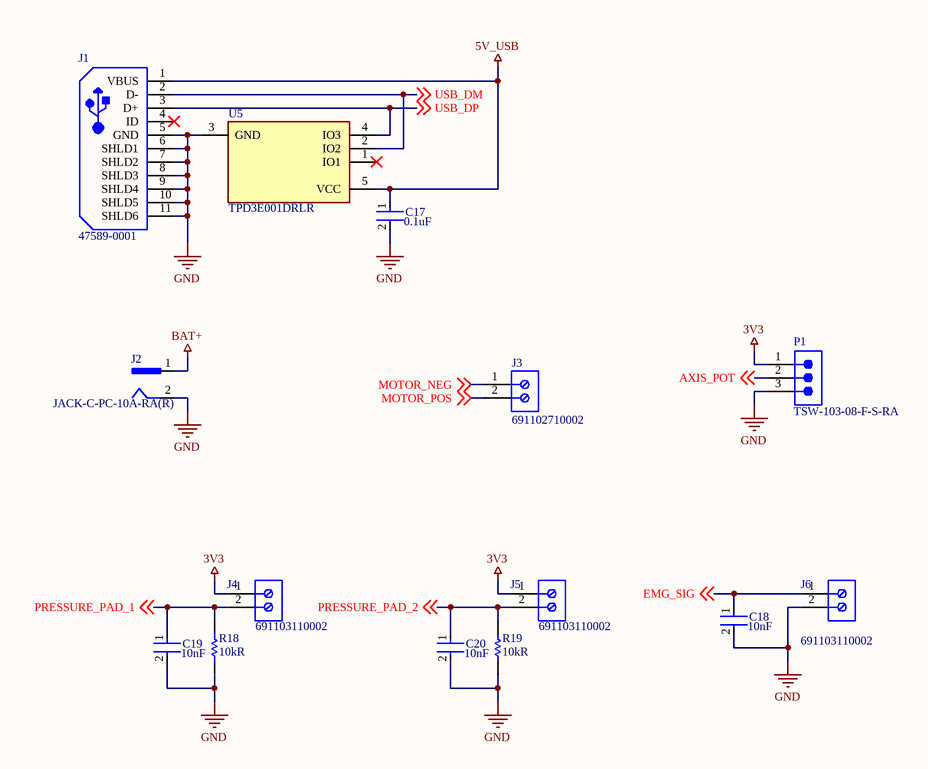
[diagram p9: Connectors.SchDoc]

### Parts
(Parts that share a designator on the sheet are numbered #1, #2 ... from top to bottom, then left to right.)
C17#2  Capacitance: 0.1uF  [FP-GCD21B-0_15-IPC_B]  (hidden comment: GCD21BR71H104MA01L)
C18#2  Capacitance: 10nF  [FP-C0805C103K8RACAUTO-MFG]  (hidden comment: C0805C103K8RACAUTO)
C19#2  Capacitance: 10nF  [FP-C0805C103K8RACAUTO-MFG]  (hidden comment: C0805C103K8RACAUTO)
C20#2  Capacitance: 10nF  [FP-C0805C103K8RACAUTO-MFG]  (hidden comment: C0805C103K8RACAUTO)
J1  47589-0001  [MOLX-47589-0001_V]
J2#2  JACK-C-PC-10A-RA(R)  [GLOBTECK_JACK-C-PC-10A-RA(R)]
J3  691102710002  [691102710002]
J4  691103110002  [691103110002]
J5  691103110002  [691103110002]
J6  691103110002  [691103110002]
P1  TSW-103-08-F-S-RA  [SMTC-TSW-103-08-X-S-RA]
R18#2  value 10kR  [RESC2013X60X35NL10T20]  (hidden comment: RC0805FR-0710KL)
R19#2  value 10kR  [RESC2013X60X35NL10T20]  (hidden comment: RC0805FR-0710KL)
U5  TPD3E001DRLR  [FP-DRL0005A-MFG]

### Nets
3V3: J4.1 J5.1 P1.1
5V_USB: C17#2.1 J1.1(VBUS) U5.5(VCC)
BAT+: J2#2.1
GND: C17#2.2 C18#2.2 C19#2.2 C20#2.2 J1.5(GND) J1.6(SHLD1) J1.7(SHLD2) J1.8(SHLD3) J1.9(SHLD4) J1.10(SHLD5) J1.11(SHLD6) J2#2.2 J6.2 P1.3 R18#2.2 R19#2.2 U5.3(GND)
AXIS_POT: P1.2 ; off-sheet AXIS_POT
EMG_SIG: C18#2.1 J6.1 ; off-sheet EMG_SIG
MOTOR_NEG: J3.1 ; off-sheet MOTOR_NEG
MOTOR_POS: J3.2 ; off-sheet MOTOR_POS
PRESSURE_PAD_1: C19#2.1 J4.2 R18#2.1 ; off-sheet PRESSURE_PAD_1
PRESSURE_PAD_2: C20#2.1 J5.2 R19#2.1 ; off-sheet PRESSURE_PAD_2
USB_DM: J1.2(D-) U5.2(IO2) ; off-sheet USB_DM
USB_DP: J1.3(D+) U5.4(IO3) ; off-sheet USB_DP

Not connected (* = marked no-connect by the designer): J1 4(ID)*; U5 1(IO1)*

### Library data of the parts
C17#2 = CMP-06035-004518-1: as C14#2 on sheet Buck_Converter
C18#2 C19#2 C20#2 = CMP-00212-126448506-1: as C? on sheet ESP32-S3; Height: 880µm; NexarPartId: 126448506; Voltage Rating: 10V; Voltage Rating (DC): 10V; Min Operating Temperature: -55°C; Max Operating Temperature: 125°C; Case/Package: 0805; RoHS: Compliant
J1 = CMP-2000-05610-1: Right Angle Female Type AB Micro USB Connector, 30 V, 1.8 A, -30 to 85 degC, RoHS, Tape and Reel; Number of Ports: 1Port; Current Rating: 1.8A; Brand: Molex; Connector Type: MicroUSBTypeABreceptacle; Number of Contacts: 5Contact; Voltage Rating: 30VAC; Color: Black; Product: MicroUSBTypeABConnectors; Package URL: http://www.molex.com/pdm_docs/sd/475890001_sd.pdf; Contact Plating: Gold; Datasheet URL: http://www.molex.com/webdocs/datasheets/pdf/en-us/0475890001_IO_CONNECTORS.pdf; Operating Temperature Range: -20Cto+85C; Termination Style: SMD/SMT; Mounting Angle: Right; Package Reference: 47589-0001; Gender: Female; Package Description: Micro USB Connector, Pitch 0.65 mm, 5 Positions, Body 7.5 x 5.6 mm; Mounting Technology: SurfaceMount; Contact Material: CopperAlloy; Packaging: Reel; RoHS: True; Standard: USB; Manufacturer URL: http://www.molex.com/; Manufacturer: Molex; Datasheet Version: 12/2016; Product Category: USBConnectors; Series: 47589
J2#2 = JACK-C-PC-10A-RA(R): Power Barrel Connector Jack 2.10mm ID _0.083_, 5.50mm OD _0.217_ Through Hole, Right Angle; MF: GlobTek, Inc.; MP: JACK-C-PC-10A-RA_R_; Value: *; Digi-Key_Purchase_URL: https://www.digikey.com/product-detail/en/globtek-inc/JACK-C-PC-10A-RA_R_/1939-1086-ND/8597889?utm_source=snapeda&utm_medium=aggregator&utm_campaign=symbol; Digi-Key_Part_Number: 1939-1086-ND; Package: None; SnapEDA_Link: https://www.snapeda.com/parts/JACK-C-PC-10A-RA%28R%29/GlobTek%2C%20Inc./view-part/3076017/?ref=snap
J3 = CMP-1502-03258-3: 102 Series 5MM Pitch Straight, Pcb Terminal Block, Through Hole, 2 Way; Current Rating: 15A; Wire/Cable Gauge: 22AWG; Voltage: 300V; Number of Positions Per Level: 2; Plating: Steel; Stripping Length: -6mm; Wire Gauge (Min): 14AWG; Number of Levels: 1; Pitch: 5.0038mm; Width: 11.2mm; Max Operating Temperature: 105°C; Contact Material: Brass; Contact Plating: Tin; Current: 15A; Wire Gauge (Max): 22AWG; Mount: Through Hole; Length: 7.5mm; Min Operating Temperature: -40°C; RoHS: Compliant; Color: Blue; Number of Pins: 2; Housing Material: Nylon; Termination: Screw; Height: 13.4mm; Number of Contacts: 2; Lead Pitch: 5mm; Voltage Rating: 300V; Packaging: Box
J4-J6 = CMP-1502-03254-3: 1031 Series 3.5MM Pitch Straight, Pcb Terminal Block, Through Hole, 2 Way; Pitch: 3.5052mm; Current Rating: 10A; Number of Positions Per Level: 2; Plating: Steel; Number of Levels: 1; Voltage: 125V; Wire/Cable Gauge: 26AWG; Stripping Length: -6mm; Wire Gauge (Min): 16AWG; Packaging: Box; Number of Rows: 1; Color: Blue; Height: 8.5mm; Current: 10A; Lead Pitch: 3.5mm; RoHS: Compliant; Housing Material: Nylon; Width: 8mm; Length: 7mm; Contact Plating: Tin; Number of Pins: 2; Mount: Through Hole; Min Operating Temperature: -40°C; Number of Contacts: 2; Termination: Screw; Wire Gauge (Max): 26AWG; Max Operating Temperature: 105°C; Voltage Rating: 125V; Contact Material: Copper, Nickel, Tin, Zinc
P1 = CMP-1024-00344-1: as P2 on sheet Axis_Potentiometer; PackageVersion: DM, 8/1988; ComponentLink3Description: Package Specification; ComponentLink2Description: Datasheet; PackageDescription: .025[0.64] SQ. Post Terminal Strip Assembly; ComponentLink3URL: http://www.samtec.com/documents/webfiles/cpdf/TSW-XXX-XX-XXX-X-XX-XXX-MKT.pdf; ComponentLink1URL: http://www.samtec.com; Mounting Technology: Through-hole; ComponentLink2URL: http://www.samtec.com/documents/webfiles/pdf/TSW_TH.PDF; RoHS: True; Temperature Range: -55 to 125 degC; Orientation: Right Angle; DatasheetVersion: F-214; ComponentLink1Description: Manufacturer URL; PackageReference: TSW-103-08-X-S-RA; PartNumber: TSW-103-08-F-S-RA
R18#2 R19#2 = CMP-1659-00013-4: Chip Resistor, 10 KOhm, +/- 1%, 0.125 W, -55 to 155 degC, 0805 (2012 Metric), RoHS, Tape and Reel; Manufacturer: Yageo; Voltage Rating: 150 V; Power: 125mW; Rated Temperature: 70°C; Temperature Coefficient: 100ppm/°C; Additional Feature: LASER TRIMMABLE; Working Voltage: 150V; Package Length: 2mm; Package Height: 0.5mm; Package Width: 1.25mm; Mount: Surface Mount; ComponentLink1Description: Manufacturer URL; ComponentLink2URL: http://www.yageo.com/documents/recent/PYu-RC_Group_51_RoHS_L_04.pdf; Pins: 2; Length: 2 mm; Min Operating Temperature: -55 degC; Height: 0.5 mm; Mounting Technology: Surface Mount; RoHSCompliant: true; REACH SVHC: No SVHC; ComponentLink1URL: http://www.yageo.com/; Max Operating Temperature: 155 degC; PackageReference: 0805; DatasheetVersion: Rev. 4, 02/2016; Package Quantity: 5000; Packaging: Tape and Reel; ComponentLink2Description: Datasheet; PackageDescription: 2-Pin Surface Mounted Device, Body 2 x 1.25 mm; Supplier: Digikey; Supplier Part Number: 311-10.0KCRCT-ND; Manufacturer Part Number: RC0805FR-0710KL; RoHS: Yes; Category: Chip SMD Resistors; Stock: 4430741; Pricing: 1=0.1, 10=0.027, 50=0.017, 100=0.0142, 500=0.00976, 1000=0.00844 (USD); Package Shape: Rectangular; Terminal Finish: Nickel; Case/Package: 0805; Tolerance: 1%; JESD-609 Code: e3; Resistor Type: FIXED RESISTOR; Construction: Chip; Package Style: SMTMeter; Technology: METAL GLAZE/THICK FILM; Termination: Wraparound; Reach SVHC Compliant: Yes; RoHS Compliant: Yes; ComponentLink3URL: https://datasheet.ciiva.com:443/pdfs/VipMasterIC/IC/YAGO/YAGO-S-A0008145938/YAGO-S-A0008145938-1.pdf?src-supplier=IHS+Markit; ComponentLink3Description: https://datasheet.ciiva.com:443/pdfs/VipMasterIC/IC/YAGO/YAGO-S-A0008145938/YAGO-S-A0008145938-1.pdf?src-supplier=IHS+Markit; ComponentLink4URL: https://datasheet.ciiva.com/11808/0900766b8106beab-11808151.pdf?src-supplier=Rs; ComponentLink4Description: https://datasheet.ciiva.com/11808/0900766b8106beab-11808151.pdf?src-supplier=Rs; ComponentLink5URL: https://datasheet.ciiva.com/46447/444164-46447563.pdf?src-supplier=Element14; ComponentLink5Description: https://datasheet.ciiva.com/46447/444164-46447563.pdf?src-supplier=Element14; ComponentLink6URL: https://datasheet.ciiva.com/2456/pyu-r-int-thick-7-2456973.pdf?src-supplier=Digikey; ComponentLink6Description: https://datasheet.ciiva.com/2456/pyu-r-int-thick-7-2456973.pdf?src-supplier=Digikey; ComponentLink7URL: https://datasheet.ciiva.com/2456/pyu-r-int-thick-7-2456974.pdf?src-supplier=Digikey; ComponentLink7Description: https://datasheet.ciiva.com/2456/pyu-r-int-thick-7-2456974.pdf?src-supplier=Digikey; ComponentLink8URL: https://datasheet.ciiva.com/2456/pyu-r-int-thick-7-2456972.pdf?src-supplier=Digikey; ComponentLink8Description: https://datasheet.ciiva.com/2456/pyu-r-int-thick-7-2456972.pdf?src-supplier=Digikey; ComponentLink9URL: https://datasheet.ciiva.com/12669/rc0805-12669688.pdf?src-supplier=Mouser; ComponentLink9Description: https://datasheet.ciiva.com/12669/rc0805-12669688.pdf?src-supplier=Mouser; ComponentLink10URL: https://datasheet.ciiva.com/16747/rc0805-16747087.pdf?src-supplier=Future+Electronics; ComponentLink10Description: https://datasheet.ciiva.com/16747/rc0805-16747087.pdf?src-supplier=Future+Electronics
U5 = CMP-0326-00052-4: TVS DIODE 5.5V SOT5; Min Supply Voltage: 900mV; Number of Bidirectional Channels: 3; Peak Pulse Power: 90W; Direction: Unidirectional; Leakage Current: 1nA; Interface: USB; Max Supply Current: 100nA; Capacitance: 1.5pF; Breakdown Voltage: 11V; Clamping Voltage: 105.5V; Power Line Protection: Yes; Packaging: Tape and Reel; Length: 1.6mm; REACH SVHC: No SVHC; Min Operating Temperature: -40°C; Lead Free: Lead Free; Max Supply Voltage: 5.5V; RoHS Compliant: Yes; Termination: SMD/SMT; Number of Channels: 3; Max Supply Voltage (DC): 5.5V; Weight: 9.9E-05oz; Package Quantity: 1; Reverse Standoff Voltage: 5.5V; Number of Pins: 5; Case/Package: SOT-553; Max Operating Temperature: 85°C; Nominal Supply Current: 1nA; Width: 1.2mm; Min Breakdown Voltage: 11V; Min Supply Voltage (DC): 900mV; Height: 0.55mm; Radiation Hardening: No; Depth: 1.2mm

## Nets that join several sheets
3V3: MCU (C10#1.1 C11#1.1 R7#1.1 U3.2), Power (3V3#1.1 C2.1 D3#1.2 U1.3), USB (C8#2.1 R7#2.2 U4#1.6 U4#1.7), Buck_Converter (3V3#2.1 C13#2.1 D9.2 U6.3), ESP32-S3 (C21.1 C22.1 R19#1.2 R20#1.2), Axis_Potentiometer (P2.3 R20#2.1), Connectors (J4.1 J5.1 P1.1)
5V: Power (7 pins), Buck_Converter (7 pins)
5V_BAT: Power (5 pins), Buck_Converter (5 pins)
5V_USB: Power (5V_USB#1.1 D4#1.2), USB (D3#2.1), Buck_Converter (5V_USB#2.1 D?#2.2), Connectors (C17#2.1 J1.1 U5.5)
BAT+: Power (5 pins), Motor (Q1#2.4), Buck_Converter (5 pins), Motor_Driver (Q3.5-6-7-8), Connectors (J2#2.1)
GND: MCU (19 pins), Power (13 pins), USB (16 pins), Motor (9 pins), Programming (C10#2.2 C11#2.2 SW2#2.1 SW3#2.1), Buck_Converter (13 pins), ESP32-S3 (21 pins), Axis_Potentiometer (P2.1 R20#2.3), Motor_Driver (9 pins), Connectors (17 pins)
AXIS_POT: MCU (C13#1.1 U3.19), ESP32-S3 (C?.1 U8.19), Axis_Potentiometer (P2.2 R20#2.2 R20#2.2'), Connectors (P1.2)
EMG_SIG: MCU (U3.21), ESP32-S3 (U8.21), Connectors (C18#2.1 J6.1)
EN: USB (Q1#1.3), Programming (C11#2.1 SW3#2.4)
IO0: USB (Q2.3), Programming (C10#2.1 SW2#2.4)
MOTOR_CCW: MCU (U3.6), Motor (R13#1.1), ESP32-S3 (U8.6), Motor_Driver (R25.1)
MOTOR_CS: MCU (U3.20), Motor (C16#1.1 R16#1.1), ESP32-S3 (U8.20), Motor_Driver (C26.1 R28.1)
MOTOR_CW: MCU (U3.5), Motor (R12.1), ESP32-S3 (U8.5), Motor_Driver (R24.1)
MOTOR_NEG: Motor (U4#2.7 U4#2.10), Motor_Driver (U9.7 U9.10), Connectors (J3.1)
MOTOR_POS: Motor (U4#2.2 U4#2.15), Motor_Driver (U9.2 U9.15), Connectors (J3.2)
MOTOR_PWM: MCU (U3.4), Motor (R14#1.1), ESP32-S3 (U8.4), Motor_Driver (R26.1)
MOTOR_SEL: MCU (U3.7), Motor (R15#1.1), ESP32-S3 (U8.7), Motor_Driver (R27.1)
PRESSURE_PAD_1: MCU (U3.39), ESP32-S3 (U8.39), Connectors (C19#2.1 J4.2 R18#2.1)
PRESSURE_PAD_2: MCU (U3.38), ESP32-S3 (U8.38), Connectors (C20#2.1 J5.2 R19#2.1)
USB_DM: MCU (R9#1.2), USB (D5#1.2 J2#1.2 U4#1.5), ESP32-S3 (R21.2), Connectors (J1.2 U5.2)
USB_DP: MCU (R10#1.2), USB (D4#2.2 J2#1.3 U4#1.4), ESP32-S3 (R22.2), Connectors (J1.3 U5.4)